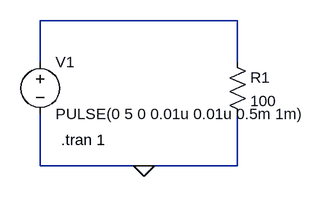
[diagram p0: schematic Square wave generator2.asc]
Square wave generator2.asc, the LTspice schematic file:
Version 4
SHEET 1 880 680
WIRE 528 192 224 192
WIRE 224 256 224 192
WIRE 528 256 528 192
WIRE 224 416 224 336
WIRE 384 416 224 416
WIRE 528 416 528 336
WIRE 528 416 384 416
FLAG 384 416 0
SYMBOL voltage 224 240 R0
SYMATTR InstName V1
SYMATTR Value PULSE(0 5 0 0.01u 0.01u 0.5m 1m)
SYMBOL res 512 240 R0
SYMATTR InstName R1
SYMATTR Value 100
TEXT 256 376 Left 2 !.tran 1

The netlist it stands for:
* Square wave generator2.asc
V1 N001 0 PULSE(0 5 0 0.01u 0.01u 0.5m 1m)
R1 N001 0 100
.tran 1
.backanno
.end